# EAGLE schematic Third try-following diagram (EAGLE 9.6.2)
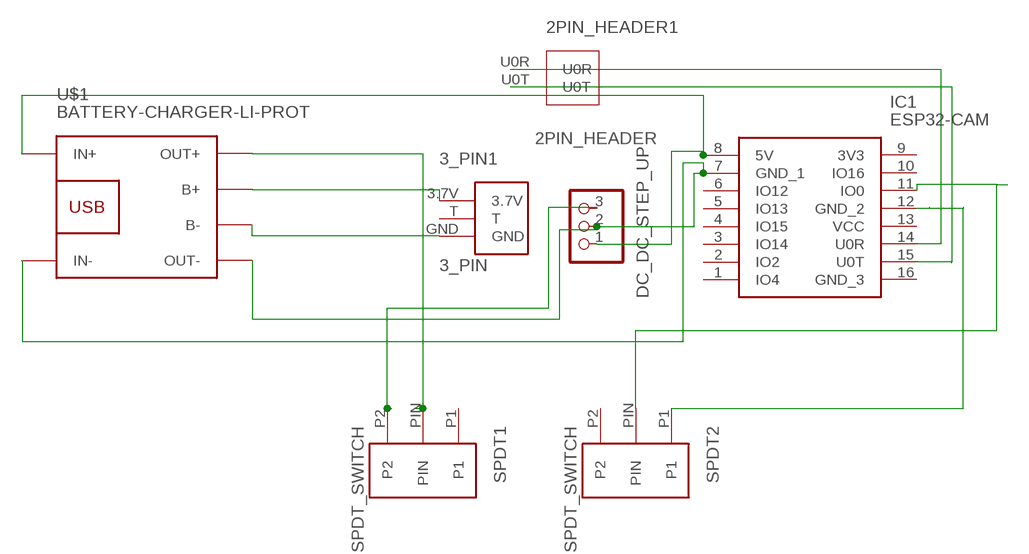
[diagram p0: schematic, sheet 1]

## Parts
2PIN_HEADER1  2PIN_HEADER  [2PIN_HEADER]
3_PIN1  3_PIN  [3_PIN]
DC_DC_STEP_UP  PINHD-1X3  [1X03]
IC1  ESP32-CAM  [ESP32CAM]
SPDT1  SPDT_SWITCH  [SPDT_SWITCH]
SPDT2  SPDT_SWITCH  [SPDT_SWITCH]
U$1  BATTERY-CHARGER-LI-PROT  [BATTERY-CHARGER-LI-PROT]

## Nets
N$1: DC_DC_STEP_UP.1 IC1.8(5V) U$1.IN+
N$2: DC_DC_STEP_UP.3 SPDT1.P2
N$4: 3_PIN1.3.7V U$1.B+
N$5: IC1.11(IO0) SPDT2.PIN
N$6: IC1.12(GND_2) SPDT2.P1
N$8: 2PIN_HEADER1.U0R IC1.14(U0R)
N$9: 2PIN_HEADER1.U0T IC1.15(U0T)
N$10: 3_PIN1.GND U$1.B-
N$11: SPDT1.PIN U$1.OUT+
N$12: DC_DC_STEP_UP.2 IC1.7(GND_1) U$1.IN- U$1.OUT-
Unconnected: 3_PIN1.T IC1.1(IO4) IC1.2(IO2) IC1.3(IO14) IC1.4(IO15) IC1.5(IO13) IC1.6(IO12) IC1.9(3V3) IC1.10(IO16) IC1.13(VCC) IC1.16(GND_3) SPDT1.P1 SPDT2.P2

## Library data of the parts
2PIN_HEADER1 = 2pin_HEADER:2PIN_HEADER
3_PIN1 = 3_pin:3_PIN
DC_DC_STEP_UP = pinhead:PINHD-1X3: PIN HEADER
IC1 = ESP32-CAM:ESP32-CAM: Modules PCBA Module RoHS Source: Datasheet <https://datasheet.lcsc.com/szlcsc/Ai-Thinker-ESP32-CAM_C277946.pdf>; DESCRIPTION: Modules PCBA Module RoHS; HEIGHT: 5mm; MANUFACTURER_NAME: Ai-Thinker; MANUFACTURER_PART_NUMBER: ESP32-CAM
SPDT1 SPDT2 = SPDT_SWITCH:SPDT_SWITCH
U$1 = diy-modules:BATTERY-CHARGER-LI-PROT: Lithium Battery 5V Charger with protection circuit More details available here: http://www.instructables.com/id/DIY-Lithium-ion-Battery-Charger/step4/TP4056-based-lithium-ion-battery-charger-module/ Click here to find device on ebay.com <http://www.ebay.com/sch/tp4056+charger+usb+protection>